# EasyEDA Pro project MAR.eprj

# Schematic Schematic1
Board Name: Board1; Create Date: 2025-08-20; Page Name: P1; Project Name: MAR; Schematic Name: Schematic1; Update Date: 2025-08-24; Company: EasyEDA.com; Page Size: A4; Version: V1.0
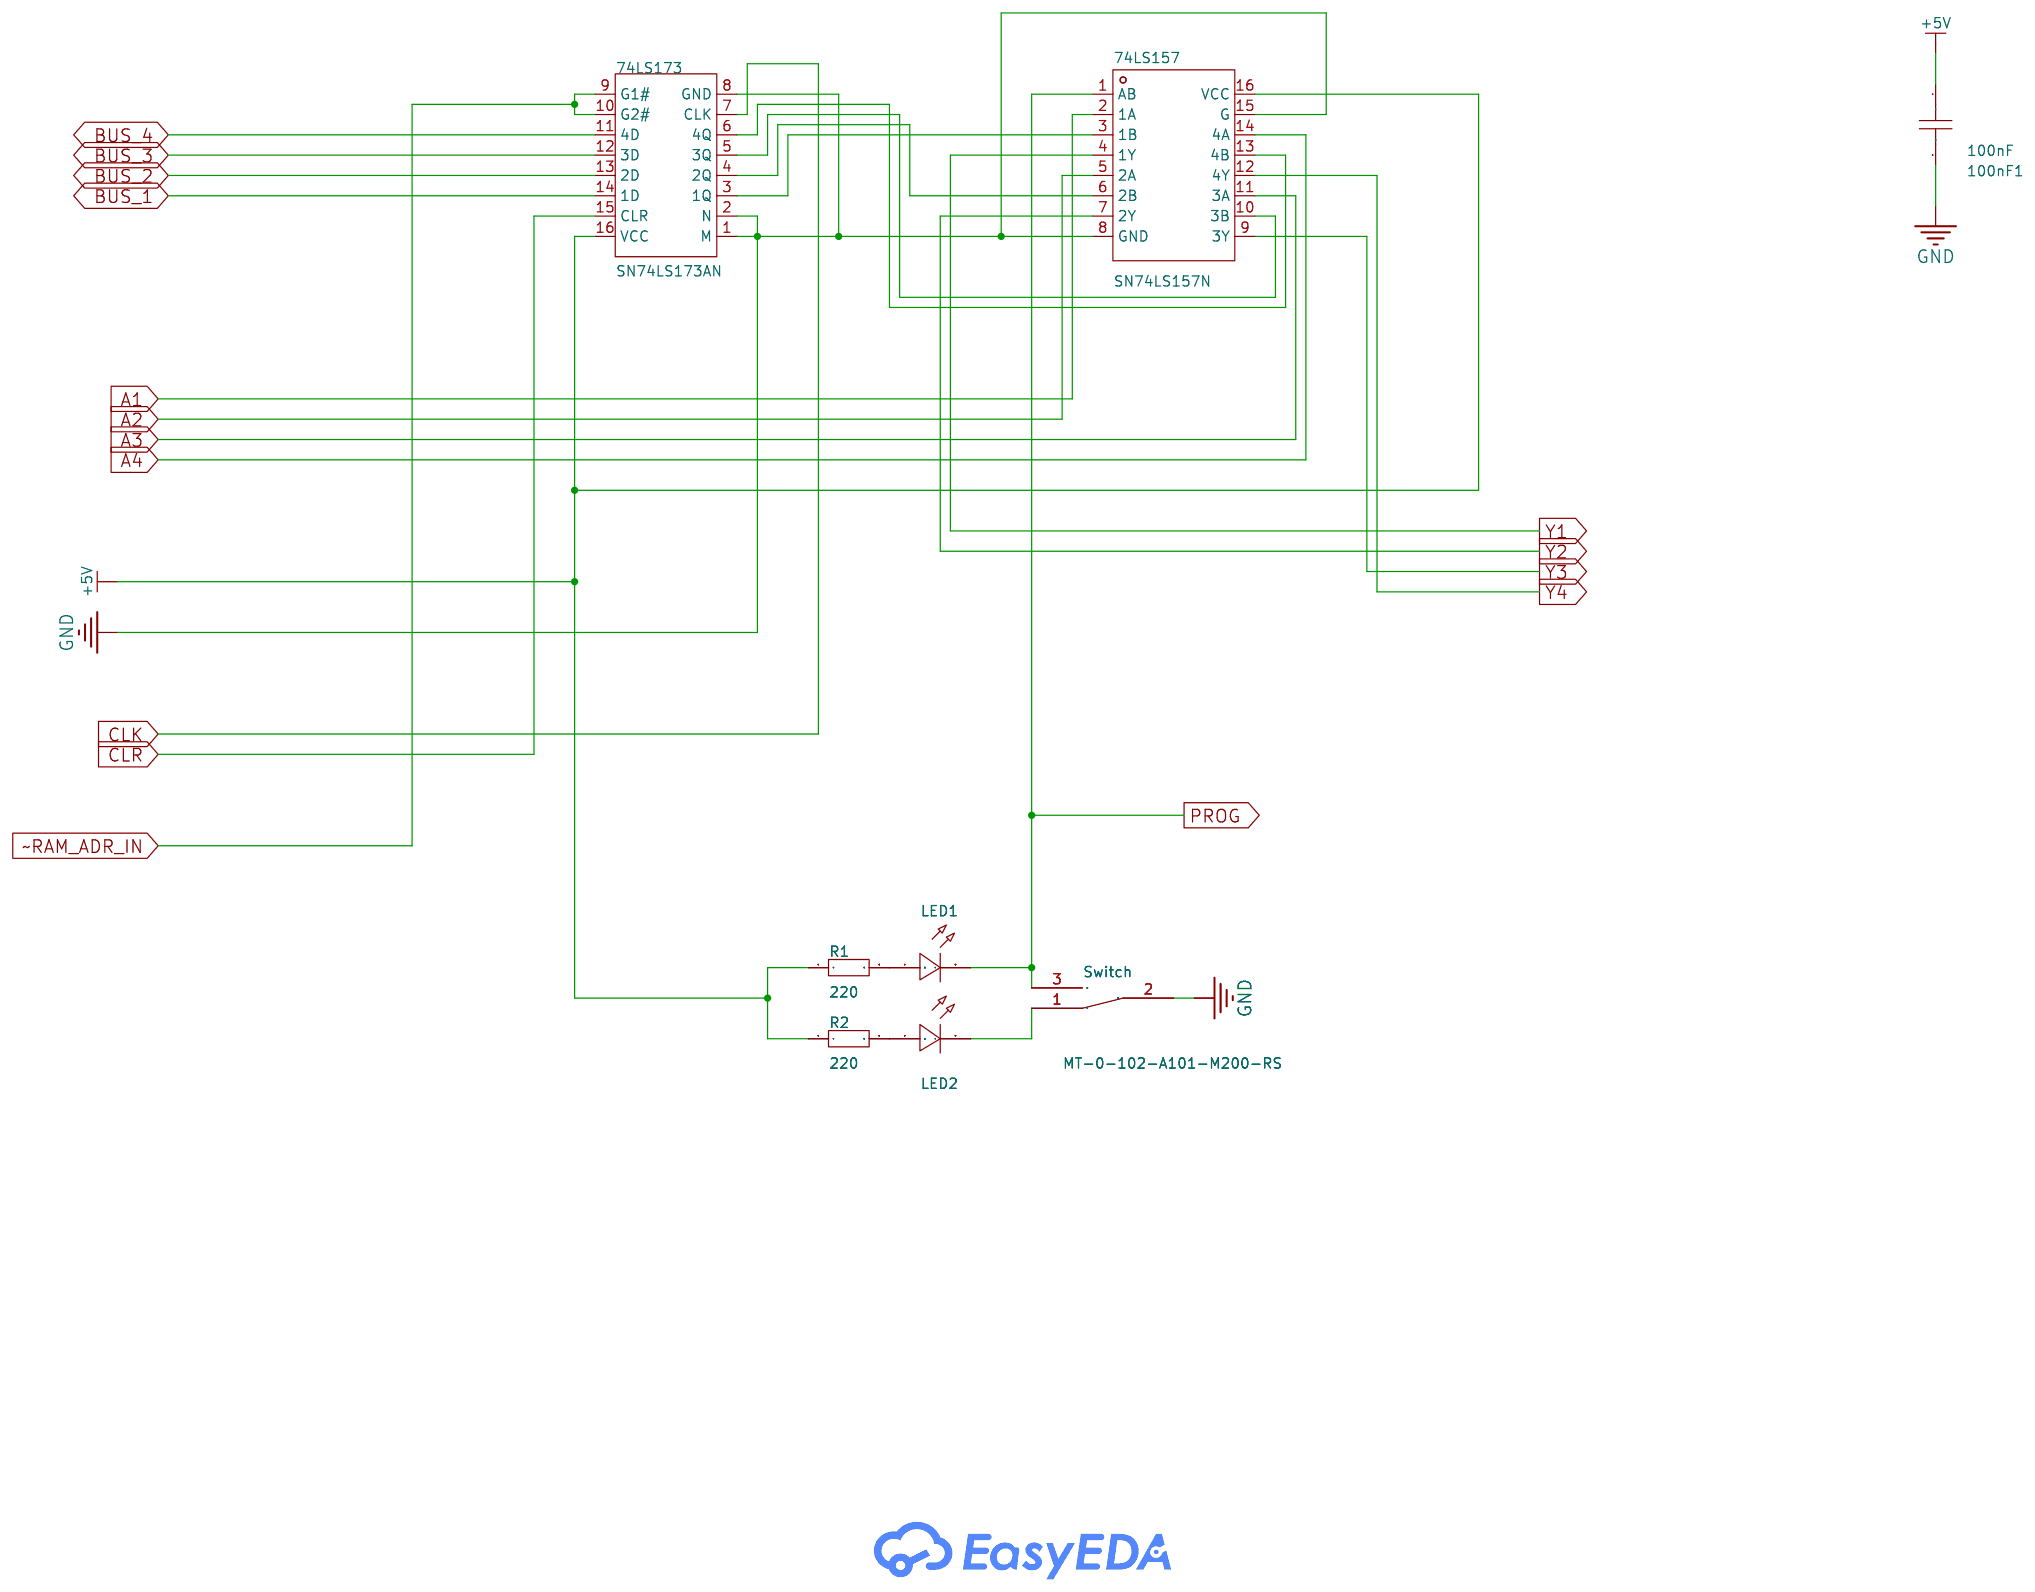
[diagram p0: schematic sheet]

## Parts
74LS157  SN74LS157N  [DIP-16_16P-L20.2-W6.6-P2.54-LS7.6-BL]
74LS173  SN74LS173AN  [PDIP-16_L19.3-W6.4-P2.54-LS7.94-BL]
100nF1  100nF  [CAP-TH_L8.5-W5.0-P5.00-D1.2]
LED1  -  [LED-TH_BD5.8-P2.54-FD]
LED2  -  [LED-TH_BD5.8-P2.54-FD]
R1  220  [R_AXIAL-0.4]
R2  220  [R_AXIAL-0.4]
Switch  MT-0-102-A101-M200-RS  [SW-TH_MT-0-103-A101-M200-RS]

## Library data of the parts
74LS157 = SN74LS157N: Supplier Part: C139317; Manufacturer: TI(德州仪器); Supplier Footprint: DIP-16; JLCPCB Part Class: Extended Part; Datasheet: https://www.ti.com/cn/lit/gpn/sn74ls157; Supplier: LCSC; Type: Multiplexers; Voltage Supply Source: Single supply; Supply Voltage: 4.75V~5.25V; Sink Current: 8mA; Source Current: 400uA; Operating temperature: 0℃~+70℃
74LS173 = SN74LS173AN: Type:D-Type Trigger Type:Rising Edge Voltage - Supply:4.75V~5.25V Voltage - Supply:4.75V~5.25V Clock Frequency:50MHz Function:Reset Number of Elements:1 Number of Bits per Element:4 Output Type:- Propagation Delay:30ns@5V,45pF Series:74LS Series Current -; Supplier Part: C1550125; Manufacturer: TI(德州仪器); Supplier Footprint: PDIP-16; JLCPCB Part Class: Extended Part; Datasheet: https://www.ti.com/cn/lit/gpn/sn74ls173a; Supplier: LCSC; Type: D-Type; Trigger Type: Rising Edge; Voltage - Supply: 4.75V~5.25V; Clock Frequency: 50MHz; Function: Reset; Number of Elements: 1; Number of Bits per Element: 4; Propagation Delay: 30ns@5V,45pF; Series: 74LS Series; Current - Output Low(IOL): 24mA; Current - Output High(IOH): 2.6mA; Quiescent Current: 24mA; Operating Temperature: 0℃~+70℃
100nF1 = CT4-0805B104K500F3: Capacitance:100nF Tolerance:±10% Tolerance:±10% Voltage Rated: Temperature Coefficient:; LCSC Part Name: 100nF ±10% 50V C3型（直脚）; Supplier Part: C84772; Manufacturer: FH(风华); Supplier Footprint: 插件,P=5.08mm; JLCPCB Part Class: Extended Part; Datasheet: https://atta.szlcsc.com/upload/public/pdf/source/20190402/C385200_059806A6312B28FF1421A2413EB641E1.pdf; Supplier: LCSC; Tolerance: ±10%
LED1 LED2 = LED_TH-R_5mm: Supplier Footprint: Through
R1 R2 = Res_AXIAL-1/4W: Supplier Footprint: Through
Switch = MT-0-102-A101-M200-RS: Circuit:Single Pole Double Throw (SPDT) Switch Length:13mm Switch Width:8mm Switch Height:28.6mm Mechanical Life:- Contact Current:5A Voltage Rating (AC):125V Actuator Type:Cylinder knob Pin Style:Solder Mounting Style:Direct Insert Operating Temperature:; LCSC Part Name: 小型钮子三脚二档 五件套; Supplier Part: C1788492; Manufacturer: YUEN FUNG(源丰); Supplier Footprint: 插件; JLCPCB Part Class: Extended Part; Datasheet: https://atta.szlcsc.com/upload/public/pdf/source/20230720/8E5C36EFDF374AE4FF4AC09DB233CE0E.pdf; Supplier: LCSC; Circuit: Single Pole Double Throw (SPDT); Switch Length: 13mm; Switch Width: 8mm; Switch Height: 28.6mm; Contact Current: 5A; Voltage Rating (AC): 125V; Actuator Type: Cylinder knob; Pin Style: Solder; Mounting Style: Direct Insert; Operating Temperature: -25℃~+85℃

## Nets
+5V: 74LS157.16(VCC) 74LS173.16(VCC) 100nF1.1 R1.1 R2.1
GND: 74LS157.8(GND) 74LS157.15(G) 74LS173.1(M) 74LS173.2(N) 74LS173.8(GND) 100nF1.2 Switch.2
A1: 74LS157.2(1A)
A2: 74LS157.5(2A)
A3: 74LS157.11(3A)
A4: 74LS157.14(4A)
BUS_1: 74LS173.14(1D)
BUS_2: 74LS173.13(2D)
BUS_3: 74LS173.12(3D)
BUS_4: 74LS173.11(4D)
CLK: 74LS173.7(CLK)
CLR: 74LS173.15(CLR)
PROG: 74LS157.1(AB) LED1.2(A) Switch.3
Y1: 74LS157.4(1Y)
Y2: 74LS157.7(2Y)
Y3: 74LS157.9(3Y)
Y4: 74LS157.12(4Y)
~RAM_ADR_IN: 74LS173.9(G1#) 74LS173.10(G2#)
Net-(74LS157-3): 74LS157.3(1B) 74LS173.3(1Q)
Net-(74LS157-6): 74LS157.6(2B) 74LS173.4(2Q)
Net-(74LS157-10): 74LS157.10(3B) 74LS173.5(3Q)
Net-(74LS157-13): 74LS157.13(4B) 74LS173.6(4Q)
Net-(LED1-1): LED1.1(C) R1.2
Net-(LED2-1): LED2.1(C) R2.2
Net-(LED2-2): LED2.2(A) Switch.1
